# Altium schematic sheet External_Board_1mode.SchDoc: External Board Mode 1 - Resister Sense
size A4; DrawnBy: Anne Moller; Organization: Altium Limited; Address1: L3, 12a Rodborough Rd; Address2: Frenchs Forest; Address3: NSW; Address4: Australia 2086; Revision: 1.0.0; SheetNumber: 1; SheetTotal: 1
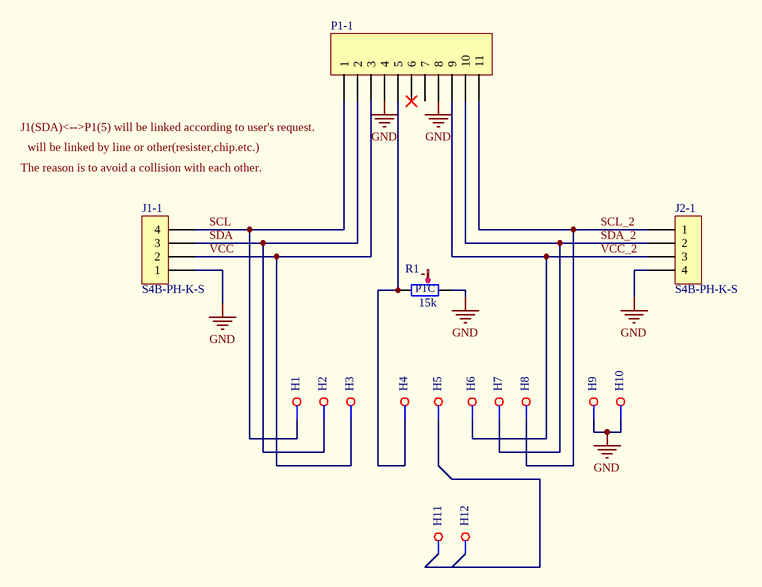
[diagram p0: External_Board_1mode.SchDoc]

## Parts
H1  TP_HOLE  [TestHole]  (value not drawn)
H2  TP_HOLE  [TestHole]  (value not drawn)
H3  TP_HOLE  [TestHole]  (value not drawn)
H4  TP_HOLE  [TestHole]  (value not drawn)
H5  TP_HOLE  [TestHole]  (value not drawn)
H6  TP_HOLE  [TestHole]  (value not drawn)
H7  TP_HOLE  [TestHole]  (value not drawn)
H8  TP_HOLE  [TestHole]  (value not drawn)
H9  TP_HOLE  [TestHole]  (value not drawn)
H10  TP_HOLE  [TestHole]  (value not drawn)
H11  TP_HOLE  [TestHole]  (value not drawn)
H12  TP_HOLE  [TestHole]  (value not drawn)
J1-1  S4B-PH-K-S  [CON4]
J2-1  S4B-PH-K-S  [CON4]
P1-1  Header11  [CON11]  (value not drawn)
R1  Resistance in Ohms @ 25°C: 15k  [PTFT1206L1501JV]  (hidden comment: PTFT1206L1501JV)

## Nets
GND: H9.1(TP) H10.1(TP) J1-1.1 J2-1.4 P1-1.4 P1-1.8 R1.1
SCL: H1.1(TP) J1-1.4 P1-1.1
SCL_2: H8.1(TP) J2-1.1 P1-1.11
SDA: H2.1(TP) J1-1.3 P1-1.2
SDA_2: H7.1(TP) J2-1.2 P1-1.10
VCC: H3.1(TP) J1-1.2 P1-1.3
VCC_2: H6.1(TP) J2-1.3 P1-1.9
NetH4_1: H4.1(TP) P1-1.5 R1.2

Not connected (* = marked no-connect by the designer): H5 1(TP); H11 1(TP); H12 1(TP); P1-1 6* 7

## Notes on the sheet
- Labels drawn without touching a wire or pin: J1(SDA)<-->P1(5) will be linked according to user's request., The reason is to avoid a collision with each other., will be linked by line or other(resister,chip.etc.)
- Title
- Size:
- Date:
- A4
- Number:
- Time:
- Revision:
- Sheet
- of
- Drawn by:
- File:
- (in symbol PTFT1206L1501JV) PTC

## Library data of the parts
H1-H12 = TP_HOLE: TEST POINT HOLE
J1-1 J2-1 = S4B-PH-K-S (LF)(SN): JST (JAPAN SOLDERLESS TERMINALS) - S4B-PH-K-S (LF)(SN) - CONNECTOR, HEADER, 2MM, 4 POSITION, 1ROW; Supplier 1: Newark; Manufacturer: JST (JAPAN SOLDERLESS TERMINALS); Manufacturer Part Number: S4B-PH-K-S (LF)(SN); RoHS: YES; Stock 1: 908; Pricing 1: 1=0.14, 250=0.126, 500=0.112, 1000=0.101, 5000=0.069 (USD); ComponentLink1URL: http://www.farnell.com/datasheets/80564.pdf; ComponentLink1Description: http://www.farnell.com/datasheets/80564.pdf
P1-1 = SFH11-PBPC-D10-ST-BK: CONN HEADR FMALE 20POS .1" DL AU; Manufacturer: Sullins Connector Solutions; Connector Type: Header; Number of Positions: 20; Number of Positions Loaded: All; Pitch: 0.100" (2.54mm); Supplier 1: Digi-Key; Manufacturer Part Number: SFH11-PBPC-D10-ST-BK; RoHS: RoHS Compliant; Category: Connectors, Interconnects; Stock 1: 14457; Pricing 1: 1=1.43, 10=1.185, 25=1.0976, 50=0.9878, 100=0.878, 250=0.76824, 500=0.7024, 1000=0.63655, 2500=0.5707 (USD); Packaging: Tray; Contact Type: Female Socket; Number of Rows: 2; Row Spacing: 0.100" (2.54mm); Mounting Type: Through Hole; Termination: Solder; Fastening Type: -; Features: Polarizing Key; Contact Finish: Gold; Contact Finish Thickness: Flash; Color: Black; ComponentLink1URL: http://sullinscorp.com/catalogs/146_PAGE119_.100_SFH11_SERIES_FEMALE_HDR_ST_RA.pdf; ComponentLink1Description: http://sullinscorp.com/catalogs/146_PAGE119_.100_SFH11_SERIES_FEMALE_HDR_ST_RA.pdf
R1 = PTFT1206L1501JV: THERMISTOR PTC 1.5K OHM 5% 1206; Manufacturer: Vishay Dale; Power - Max: 125mW; Supplier 1: Digi-Key; Manufacturer Part Number: PTFT1206L1501JV; RoHS: RoHS Compliant; Category: Sensors, Transducers; Stock 1: 0; Pricing 1: 1000=0 (USD); Packaging: Tape & Reel (TR); Resistance Tolerance: ±5%; Operating Temperature: -55°C ~ 125°C; Mounting Type: Surface Mount; Package / Case: 1206 (3216 Metric); Supplier Device Package: 1206; ComponentLink1URL: http://media.digikey.com/pdf/Data%20Sheets/Vishay%20Dale%20PDFs/PTFT.pdf; ComponentLink1Description: http://media.digikey.com/pdf/Data%20Sheets/Vishay%20Dale%20PDFs/PTFT.pdf